# Altium schematic sheet MergeRev3_0.SchDoc
size A
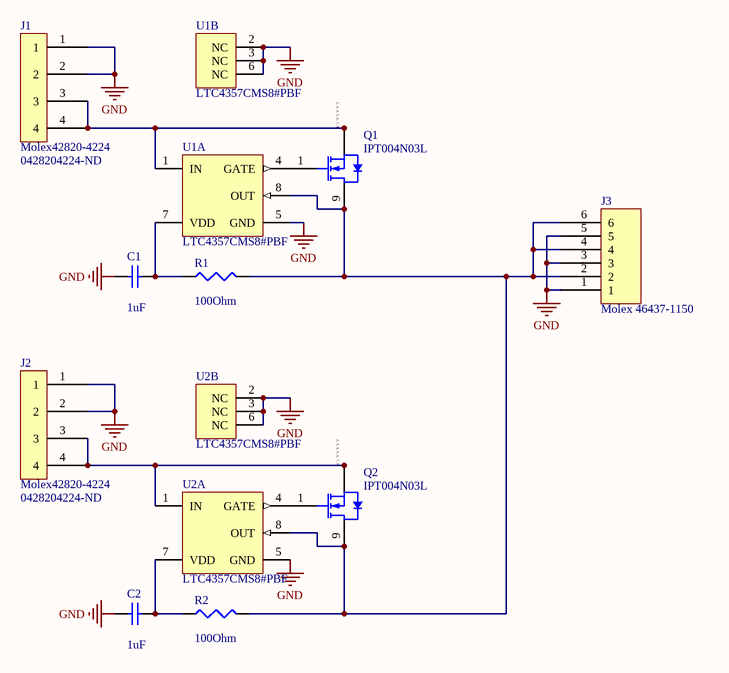
[diagram p0: MergeRev3_0.SchDoc]

## Parts
C1  value 1uF  [C1206]  (hidden comment: Cap Semi)
C2  value 1uF  [C1206]  (hidden comment: Cap Semi)
J1  Molex42820-4224  Supplier Part Number 1: 0428204224-ND  [Molex42820-4224]
J2  Molex42820-4224  Supplier Part Number 1: 0428204224-ND  [Molex42820-4224]
J3  Molex 46437-1150  [Molex 46437-1150]
Q1  IPT004N03L  [INF-PG-HSOF-8-1_V]
Q2  IPT004N03L  [INF-PG-HSOF-8-1_V]
R1  value 100Ohm  [J1-0603]  (hidden comment: Res3)
R2  value 100Ohm  [J1-0603]  (hidden comment: Res3)
U1  LTC4357CMS8#PBF  [LT-MS8-8_N]  (parts A,B of 2)
U2  LTC4357CMS8#PBF  [LT-MS8-8_N]  (parts A,B of 2)

## Nets
GND: C1.1 C2.1 J1.1 J1.2 J2.1 J2.2 J3.1 J3.3 J3.5 U1.2(NC) U1.3(NC) U1.5(GND) U1.6(NC) U2.2(NC) U2.3(NC) U2.5(GND) U2.6(NC)
NetC1_2: C1.2 R1.1 U1.7(VDD)
NetC2_2: C2.2 R2.1 U2.7(VDD)
NetJ1_3: J1.3 J1.4 Q1.2(S) Q1.3(S) Q1.4(S) Q1.5(S) Q1.6(S) Q1.7(S) Q1.8(S) U1.1(IN)
NetJ2_3: J2.3 J2.4 Q2.2(S) Q2.3(S) Q2.4(S) Q2.5(S) Q2.6(S) Q2.7(S) Q2.8(S) U2.1(IN)
NetJ3_2: J3.2 J3.4 J3.6 Q1.9(D) Q2.9(D) R1.2 R2.2 U1.8(OUT) U2.8(OUT)
NetQ1_1: Q1.1(GATE) U1.4(GATE)
NetQ2_1: Q2.1(GATE) U2.4(GATE)

## Notes on the sheet
- (in symbol IPT004N03L) 2, 3, 4, 5, 6, 7, 8

## Library data of the parts
C1 C2 = Cap Semi: Capacitor (Semiconductor SIM Model); Published: 8-Jun-2000; LatestRevisionDate: 29-May-2009; LatestRevisionNote: IPC-7351 Footprint Added.; PackageReference: C1206; Publisher: Altium Limited; PackageDescription: Chip Capacitor
J3 = Molex 46437-1150: 5.50mm Pitch EXTreme Ten60Power Right Angle Plug Assembly with Guide Pins, 6 DC Power Circuits; ComponentLink1Description: Molex Website; ComponentLink1URL: https://www.molex.com/molex/products/datasheet.jsp?part=active/0464371150_PCB_HEADERS.xml
Q1 Q2 = IPT004N03L: N-Channel OptiMOS(TM) Power-MOSFET, 30 V VDS, 300 A ID, -55 to 175 degC, PG-HSOF-8, Reel, Green; Manufacturer: Infineon; Green: TRUE; ID (max): 300 A; IDpuls (max): 1,200 A; Polarity: FALSE; Ptot (max): 300 W; QG: 122 nC; RDS (on) (max): 0.4 mOhm; RthJA (max): 40 K/W; RthJC (max): 0.5 K/W; VDS (max): 30 V; VGS(th) (max): 2.2 V; VGS(th) (min): 0.7 V; DatasheetVersion: Rev. 1.2; PackageVersion: Rev. 04; PackageReference: PG-HSOF-8-1; PackageDescription: 8-Pin Plastic (Green) Heatlink Small Outline Flat Leads Package, 10.375 x 9.9 mm Body, 0.8 mm Pitch; Supplier 1: Mouser; Supplier Part Number 1: N/A; Halogen-free: TRUE; Packing: Reel; Technology: OptiMOS(TM); Mounting Technology: Surface Mount; PartNumber: IPT004N03L; ComponentLink1Description: Manufacturer URL; ComponentLink1URL: http://www.infineon.com/; ComponentLink2Description: Datasheet; ComponentLink2URL: http://www.infineon.com/dgdl/IPT004N03L_rev1.2.pdf?folderId=db3a304313b8b5a60113cee8763b02d7&fileId=db3a30433e9d5d11013e9e0f382600c2; ComponentLink3Description: Package Specification; ComponentLink3URL: http://www.infineon.com/cms/packages/SMD_-_Surface_Mounted_Devices/P-PG-HSOF/P-PG-HSOF-08-1.html?__locale=en
R1 R2 = Res3: Resistor; Published: 8-Jun-2000; LatestRevisionDate: 29-May-2009; LatestRevisionNote: IPC-7351 Footprint Added.; PackageReference: J1-0603; Publisher: Altium Limited; PackageDescription: Chip Resistor
U1 U2 = LTC4357CMS8#PBF: Positive High Voltage Ideal Diode Controller, 9 to 80 V Vin, 8-pin SOP (MS8-8), 0 to 70 degC, Pb-Free; Manufacturer: Linear Technology; Ideal Diode: Single, External, N-Channel; DatasheetVersion: Rev. D; PackageVersion: Rev. G, 03/2012; PackageReference: MS8-8; PackageDescription: 8-Pin Plastic MSOP, Body 3 x 3 mm, Pitch 0.65 mm; Supplier 1: Digi-Key; Supplier Part Number 1: LTC4357CMS8#PBF-ND; Supplier 2: Farnell; Supplier Part Number 2: 1432779; Supplier 3: Newark; Supplier Part Number 3: 56M9468; RoHS: TRUE; Mounting Technology: Surface Mount; PartNumber: LTC4357CMS8#PBF; ComponentLink1Description: Manufacturer URL; ComponentLink1URL: http://www.linear.com/; ComponentLink2Description: Datasheet; ComponentLink2URL: http://cds.linear.com/docs/en/datasheet/4357fd.pdf; ComponentLink3Description: Package Specification; ComponentLink3URL: http://cds.linear.com/docs/en/packaging/05081660_G_MS8.pdf
J1 J2 = Molex42820-4224: Supplier 1: Digi-Key; ComponentLink1Description: DataSheet; ComponentLink1URL: https://www.molex.com/pdm_docs/sd/428204224_sd.pdf